# EAGLE design ArduinoUNO_shield (EAGLE 9.6.2)
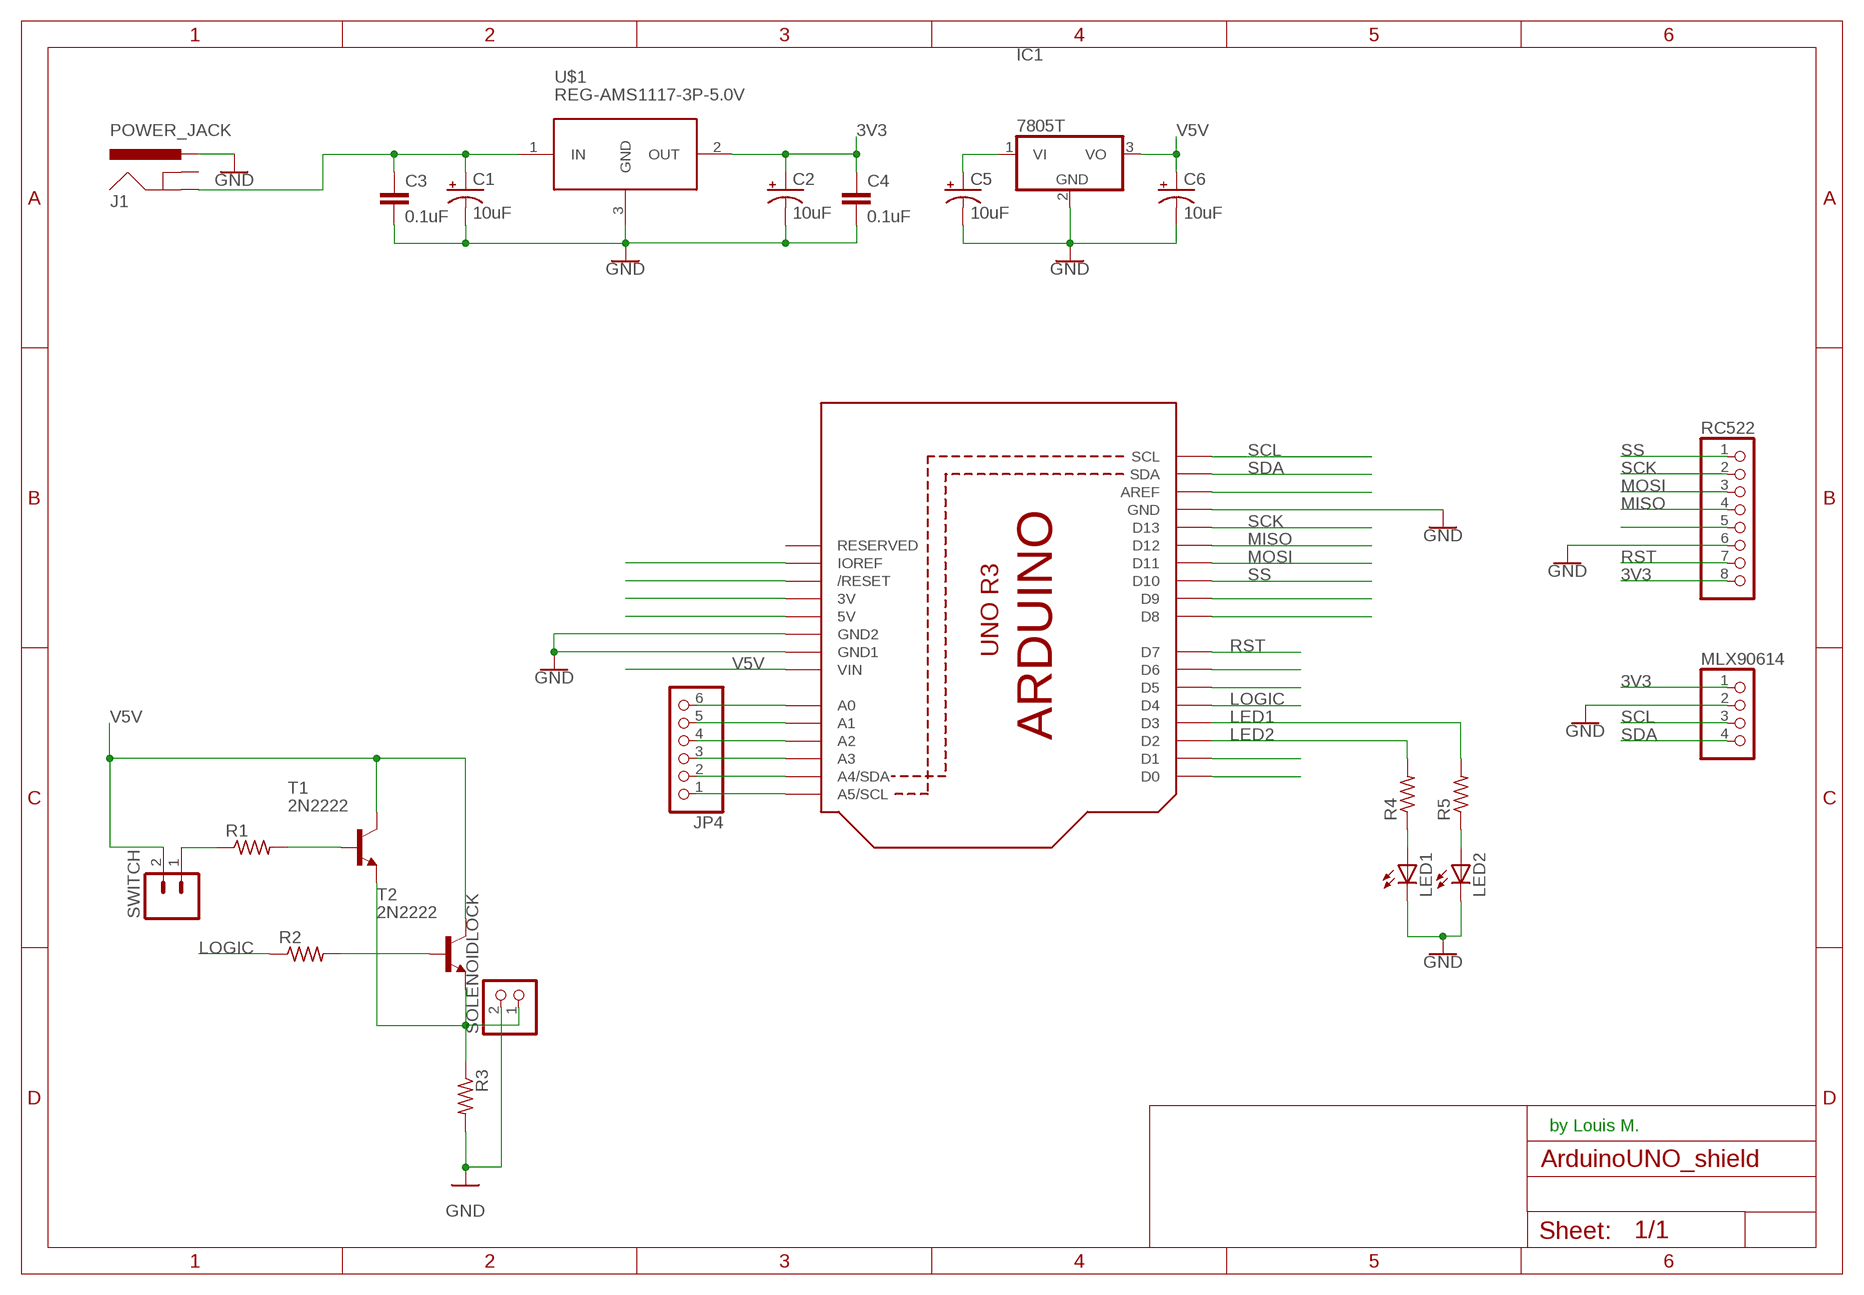
[diagram p0: schematic, sheet 1]

## Parts
C1  10uF  10UF-POLAR-RADIAL-2.5MM-KIT-25V-20%  [CPOL-RADIAL-2.5MM-5MM-KIT]
C2  10uF  10UF-POLAR-RADIAL-2.5MM-KIT-25V-20%  [CPOL-RADIAL-2.5MM-5MM-KIT]
C3  0.1uF  0.1UF-KIT-EZ-50V-20%  [CAP-PTH-SMALL-KIT]
C4  0.1uF  0.1UF-KIT-EZ-50V-20%  [CAP-PTH-SMALL-KIT]
C5  10uF  10UF-POLAR-RADIAL-2.5MM-25V-20%  [CPOL-RADIAL-2.5MM-5MM]
C6  10uF  10UF-POLAR-RADIAL-2.5MM-25V-20%  [CPOL-RADIAL-2.5MM-5MM]
IC1  7805T  [TO220H]
J1  POWER_JACK  [POWER_JACK_PTH]
JP4  PINHD-1X6B  [1X06-BIG]
LED1  LED5MM  [LED5MM]
LED2  LED5MM  [LED5MM]
MLX90614  PINHD-1X4  [1X04]
R1  R-US_0207/10  [0207/10]
R2  R-US_0207/10  [0207/10]
R3  R-US_0207/10  [0207/10]
R4  R-US_0204/5  [0204/5]
R5  R-US_0204/5  [0204/5]
RC522  PINHD-1X8  [1X08]
SOLENOIDLOCK  JST_2PIN-THM-RA  [JST-PH-2-THM-RA]
SWITCH  M02  [02P]
T1  2N2222  [TO92-EBC-OVAL]
T2  2N2222  [TO92-EBC-OVAL]
U$1  REG-AMS1117-3P-5.0V  [REG-AMS1117-3P]
UNOR3  ARDUINOR3-DIMENSION  [ARDUINOR3]

## Nets
3V3: C2.1(+) C4.1 MLX90614.1 RC522.8 U$1.2(OUT)
GND: C1.2(-) C2.2(-) C3.2 C4.2 C5.2(-) C6.2(-) IC1.2(GND) J1.PWR LED1.K(C) LED2.K(C) MLX90614.2 R3.2 RC522.6 SOLENOIDLOCK.2 U$1.3(GND) UNOR3.GND UNOR3.GND1 UNOR3.GND2
LED1: R5.2 UNOR3.D3
LED2: R4.2 UNOR3.D2
LOGIC: R2.1 UNOR3.D4
MISO: RC522.4 UNOR3.D12
MOSI: RC522.3 UNOR3.D11
N$1: R1.2 T1.B
N$2: R1.1 SWITCH.1
N$3: R2.2 T2.B
N$4: UNOR3.AREF
N$5: LED1.A R4.1
N$6: R3.1 SOLENOIDLOCK.1 T1.E T2.E
N$7: LED2.A R5.1
N$8: C5.1(+) IC1.1(VI)
N$9: C1.1(+) C3.1 J1.GND U$1.1(IN)
N$11: UNOR3.D9
N$12: UNOR3.D8
N$14: UNOR3.D6
N$15: UNOR3.D5
N$16: UNOR3.D1
N$17: UNOR3.D0
N$18: JP4.6 UNOR3.A0
N$19: JP4.5 UNOR3.A1
N$20: JP4.4 UNOR3.A2
N$21: JP4.3 UNOR3.A3
N$22: UNOR3.IOREF
N$23: UNOR3.RESET(/RESET)
N$24: UNOR3.3V
N$25: UNOR3.5V
N$27: JP4.2 UNOR3.A4(A4/SDA)
N$28: JP4.1 UNOR3.A5(A5/SCL)
N$33: RC522.5
RST: RC522.7 UNOR3.D7
SCK: RC522.2 UNOR3.D13
SCL: MLX90614.3 UNOR3.SCL
SDA: MLX90614.4 UNOR3.SDA
SS: RC522.1 UNOR3.D10
V5V: C6.1(+) IC1.3(VO) SWITCH.2 T1.C T2.C UNOR3.VIN
Unconnected: J1.GNDBREAK UNOR3.RESERVED

## Notes on the sheet
- by Louis M.

## Library data of the parts
C1 C2 C5 C6 = SparkFun-Capacitors:10UF-POLAR: 10.0µF polarized capacitors A capacitor is a passive two-terminal electrical component used to store electrical energy temporarily in an electric field.; PROD_ID: CAP-08440
C3 C4 = SparkFun-RF:0.1UF: 0.1µF ceramic capacitors A capacitor is a passive two-terminal electrical component used to store electrical energy temporarily in an electric field.; PROD_ID: CAP-08370
IC1 = linear:78*: Positive VOLTAGE REGULATOR Source: http://cache.national.com/ds/LM/LM78L05.pdf http://www.fairchildsemi.com/ds/LM/LM7805.pdf
J1 = SparkFun-Connectors:POWER_JACK: Power Jack Connector This is the standard 5.5mm barrel jack for power. The PTH is the most common, proven, reliable, footprint. The Slot footprint only works if the mill layer is transmitted to the PCB fab house so be warned. Here are the connectors we sell at SparkFun: DC Barrel Power Jack/Connector <https://www.sparkfun.com/products/119> (PRT-00119) DC Barrel Power Jack/Connector (SMD) <https://www.sparkfun.com/products/12748> (PRT-12748) DC Barrel Jack Adapter - Breadboard Compatible <https://www.sparkfun.com/products/10811> (PRT-10811) It is used on this SparkFun product (and many, many others): SparkFun RedBoard - Programmed with Arduino <https://www.sparkfun.com/products/12757> (DEV-12757) Also, if you need a mating power supply or connector, please check these out: Wall Adapter Power Supply - 9VDC 650mA <https://www.sparkfun.com/products/298> (TOL-00298) DC Barrel Jack Adapter - Male <https://www.sparkfun.com/products/10287> (PRT-10287); PROD_ID: CONN-08197
JP4 = adafruit:PINHD-1X6: PIN HEADER
LED1 LED2 = adafruit:LED: LED OSRAM: - CHIPLED LG R971, LG N971, LY N971, LG Q971, LY Q971, LO R971, LY R971 LH N974, LH R974 LS Q976, LO Q976, LY Q976 LO Q996 - Hyper CHIPLED LW Q18S LB Q993, LB Q99A, LB R99A - SideLED LS A670, LO A670, LY A670, LG A670, LP A670 LB A673, LV A673, LT A673, LW A673 LH A674 LY A675 LS A676, LA A676, LO A676, LY A676, LW A676 LS A679, LY A679, LG A679 - Hyper Micro SIDELED® LS Y876, LA Y876, LO Y876, LY Y876 LT Y87S - SmartLED LW L88C, LW L88S LB L89C, LB L89S, LG L890 LS L89K, LO L89K, LY L89K LS L896, LA L896, LO L896, LY L896 - TOPLED LS T670, LO T670, LY T670, LG T670, LP T670 LSG T670, LSP T670, LSY T670, LOP T670, LYG T670 LG T671, LOG T671, LSG T671 LB T673, LV T673, LT T673, LW T673 LH T674 LS T676, LA T676, LO T676, LY T676, LB T676, LH T676, LSB T676, LW T676 LB T67C, LV T67C, LT T67C, LS T67K, LO T67K, LY T67K, LW E67C LS E67B, LA E67B, LO E67B, LY E67B, LB E67C, LV E67C, LT E67C LW T67C LS T679, LY T679, LG T679 LS T770, LO T770, LY T770, LG T770, LP T770 LB T773, LV T773, LT T773, LW T773 LH T774 LS E675, LA E675, LY E675, LS T675 LS T776, LA T776, LO T776, LY T776, LB T776 LHGB T686 LT T68C, LB T68C - Hyper Mini TOPLED® LB M676 - Mini TOPLED Santana® LG M470 LS M47K, LO M47K, LY M47K Source: http://www.osram.convergy.de/
MLX90614 = pinhead:PINHD-1X4: PIN HEADER
R1-R5 = adafruit:R-US_: RESISTOR, American symbol
RC522 = pinhead:PINHD-1X8: PIN HEADER
SOLENOIDLOCK = adafruit:JST_2PIN: JST 2-Pin Connectors of various flavors SMT-RA (S2B-PH-SM4) 4UConnector #17311 SMT (B2B-PH-SM4) THM-RA (S2B-PH) THM (B2B-PH)
SWITCH = con-amp-quick:M02: AMP QUICK CONNECTOR; OC_FARNELL: unknown; OC_NEWARK: unknown
T1 T2 = adafruit:2N2222: NPN TRANSISTOR Big oval pads
U$1 = diy-modules:REG-AMS1117-3P-*: Linear Regulator based on AMS1117 chip 3-pin version AMS1117 datasheet is available here: http://www.advanced-monolithic.com/pdf/ds1117.pdf Click here to find device on ebay.com <http://www.ebay.com/sch/ams1117+module> Note: There are many variants. Search for the proper version.
UNOR3 = adafruit:ARDUINOR3: This is a new object for the new Arduino R3 - with extra pins that you may want to use (such as IOref, and duplicated A4/A5

## Board
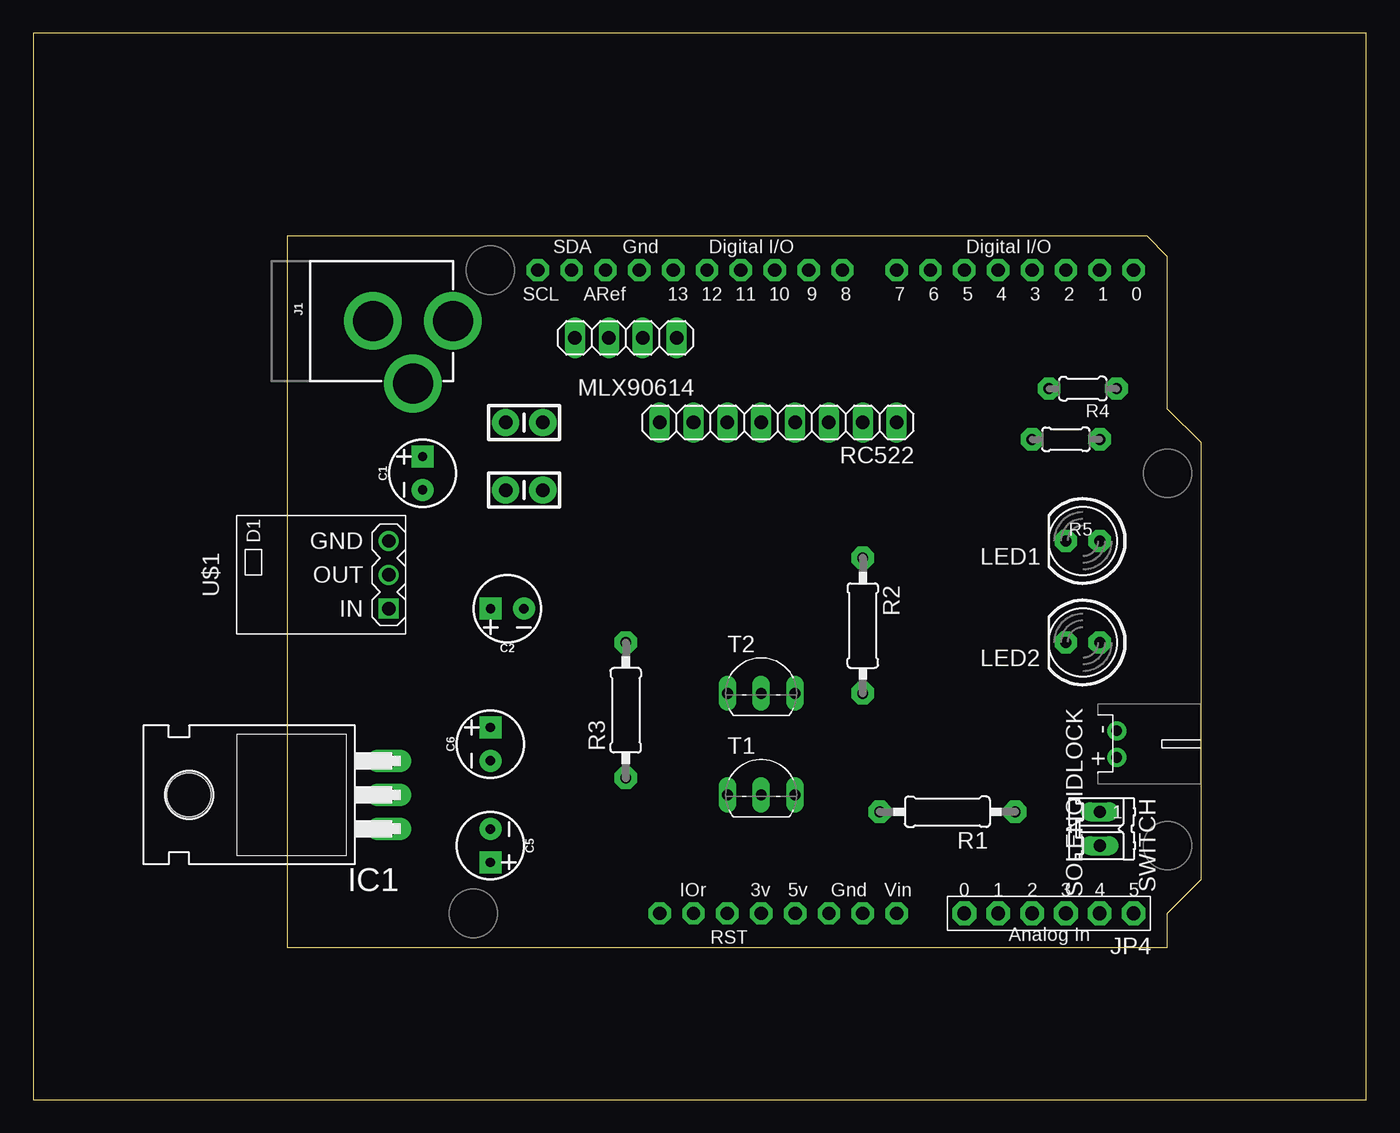
[diagram p1: board, top side]
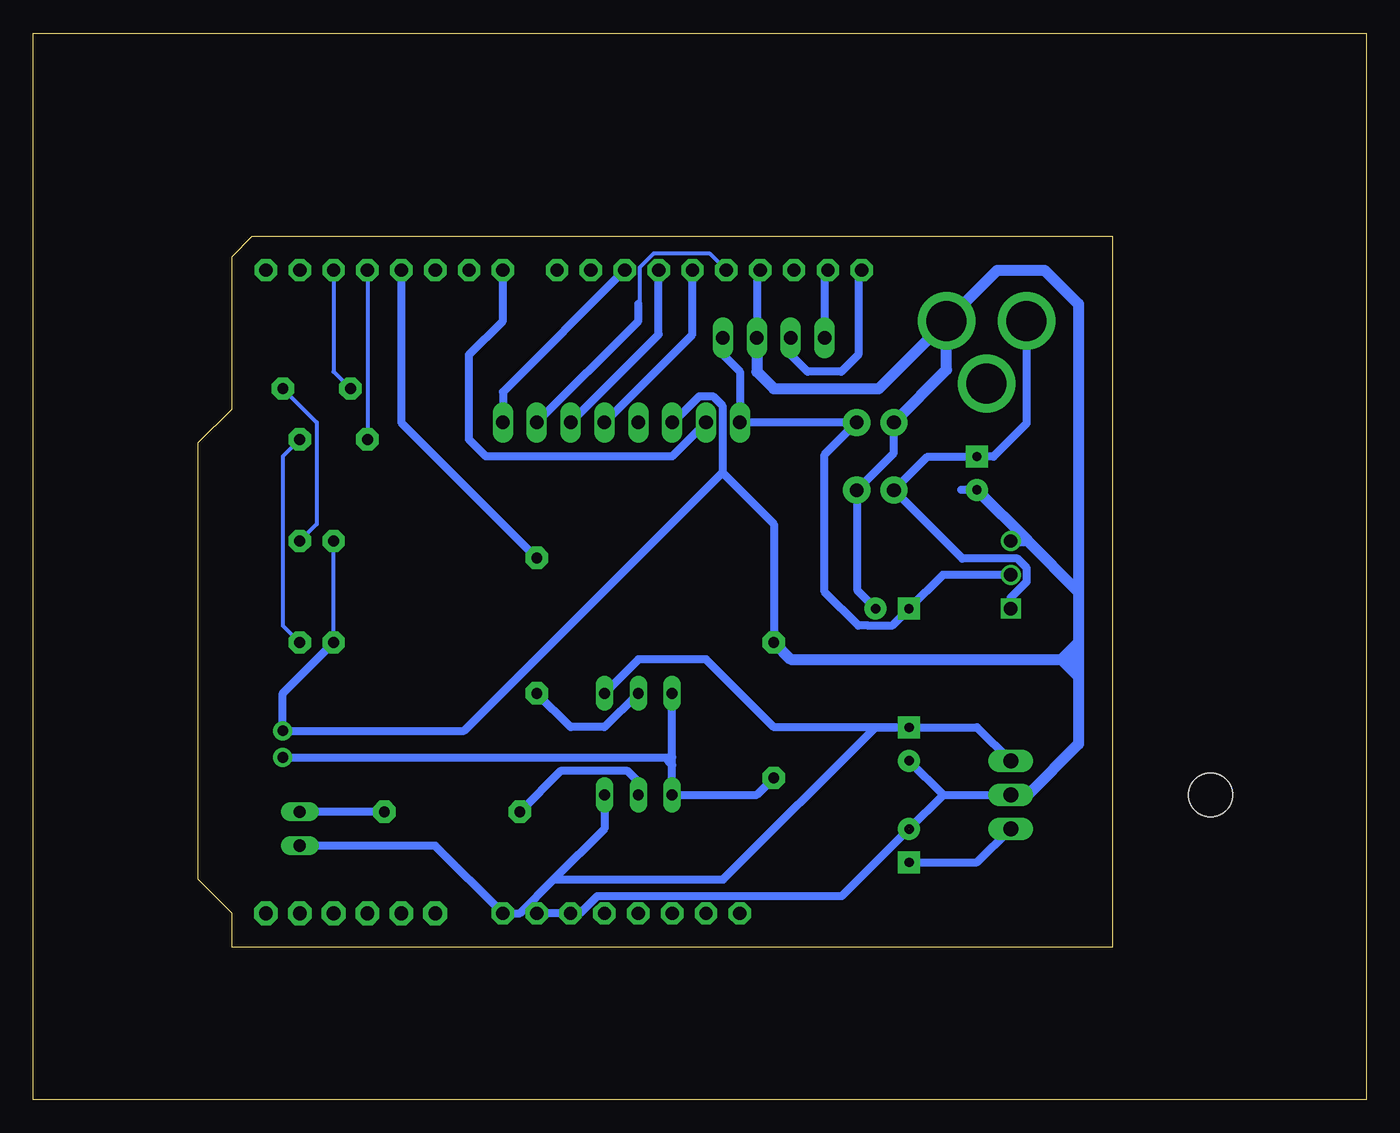
[diagram p2: board, bottom side, seen from below]

Size 100 x 80 mm. Coordinates in mm from the lower left corner, seen from the top.
Outline: 0,0 100,0 100,80 0,80 0,0
Copper layers (1*16): Top 0.035mm / dielectric 1.5mm / Bottom 0.035mm
Design rules "default": minimum track width 6mil, minimum drill 0.35mm, track to track 6mil, track to pad 6mil, pad to pad 6mil, via to via 6mil, smd to smd 6mil, copper to edge 40mil, drill to drill 6mil, minimum pad ring 10mil, minimum via ring 8mil, stop-mask expansion 4mil, vias tented up to drill 0mil, thermal gap 10mil

### Footprints (pad centres in the part's own frame; a part is rotated, then mirrored left to right if it is on the bottom)
CPOL-RADIAL-2.5MM-5MM-KIT = drill 0.7 pad 1.651 square: 1 1.25,0 | drill 0.7 pad 1.651: 2 -1.25,0
CAP-PTH-SMALL-KIT = drill 1.016 pad 2.032: 1 -1.397,0; 2 1.397,0
CPOL-RADIAL-2.5MM-5MM = drill 0.7 pad 1.651 square: 1 1.25,0 | drill 0.7 pad 1.651: 2 -1.25,0
TO220H = drill 1.118 long: 1 -2.54,-10.16; 2 0,-10.16; 3 2.54,-10.16 | hole 3.302: 0,4.826
POWER_JACK_PTH = drill 2.997 pad 4.318: GND 0,7.7; GNDBREAK 4.7,10.7; PWR 0,13.7
1X06-BIG = drill 1.016 pad 1.778 octagon: 1 -6.35,0; 2 -3.81,0; 3 -1.27,0; 4 1.27,0; 5 3.81,0; 6 6.35,0
LED5MM = drill 0.813 pad 1.676 octagon: A -1.27,0; K 1.27,0
1X04 = drill 1.016 long: 1 -3.81,0; 2 -1.27,0; 3 1.27,0; 4 3.81,0
0207/10 = drill 0.813 pad 1.676 octagon: 1 -5.08,0; 2 5.08,0
0204/5 = drill 0.813 pad 1.676 octagon: 1 -2.54,0; 2 2.54,0
1X08 = drill 1.016 long: 1 -8.89,0; 2 -6.35,0; 3 -3.81,0; 4 -1.27,0; 5 1.27,0; 6 3.81,0; 7 6.35,0; 8 8.89,0
JST-PH-2-THM-RA = drill 0.8 pad 1.422: 1 1,0; 2 -1,0
02P = drill 0.914 long: 1 -1.27,0; 2 1.27,0
TO92-EBC-OVAL = drill 0.813 long: B 0,-1.27; C 2.54,-1.27; E -2.54,-1.27
REG-AMS1117-3P = drill 1 square: 1 -2.54,-5.08 | drill 1: 2 0,-5.08; 3 2.54,-5.08
ARDUINOR3 = drill 1 pad 1.676 octagon: 3V 35.56,2.54; 5V 38.1,2.54; A0 50.8,2.54; A1 53.34,2.54; A2 55.88,2.54; A3 58.42,2.54; A4 60.96,2.54; A5 63.5,2.54; AREF 23.876,50.8; D0 63.5,50.8; D1 60.96,50.8; D2 58.42,50.8; D3 55.88,50.8; D4 53.34,50.8; D5 50.8,50.8; D6 48.26,50.8; D7 45.72,50.8; D8 41.656,50.8; D9 39.116,50.8; D10 36.576,50.8; D11 34.036,50.8; D12 31.496,50.8; D13 28.956,50.8; GND 26.416,50.8; GND1 43.18,2.54; GND2 40.64,2.54; IOREF 30.48,2.54; RESERVED 27.94,2.54; RESET 33.02,2.54; SCL 18.796,50.8; SDA 21.336,50.8; VIN 45.72,2.54

### Placement (x,y rotation side)
C1  29.21,46.99 90 top
C2  35.56,36.83 180 top
C3  36.83,45.72 0 top
C4  36.83,50.8 180 top
C5  34.29,19.05 270 top
C6  34.29,26.67 90 top
IC1  16.51,22.86 90 top
J1  17.78,58.42 270 top
JP4  76.2,13.97 180 top
LED1  78.74,41.91 180 top
LED2  78.74,34.29 180 top
MLX90614  44.45,57.15 180 top
R1  68.58,21.59 180 top
R2  62.23,35.56 270 top
R3  44.45,29.21 90 top
R4  78.74,53.34 180 top
R5  77.47,49.53 180 top
RC522  55.88,50.8 180 top
SOLENOIDLOCK  81.28,26.67 270 top
SWITCH  80.01,20.32 270 top
T1  54.61,24.13 0 top
T2  54.61,31.75 0 top
U$1  21.59,39.37 90 top
UNOR3  19.05,11.43 0 top

### Tracks (layer width: path | path; a pad name or v marks a point on that pad's centre or on a via)
3V3
  Bottom 0.61: MLX90614.1 48.26,55.88 46.99,54.61 RC522.8 C4.1 40.64,48.39 40.64,38.1 38.1,35.56 37.35,35.56 37.34,35.55 35.59,35.55 C2.1 31.77,39.37 U$1.2
GND  (1 unrouted)
  Bottom 0.305: LED2.K LED1.K
  Bottom 0.406: C6.2 31.75,22.88 26.68,22.88
  Bottom 0.61: 35.43,49.78 C4.2 35.43,48.51 38.16,45.78 | UNOR3.GND 45.72,61.98 MLX90614.2 | C1.2 30.37,45.74 | C3.2 38.16,45.78 | R3.2 44.45,43.18 48.31,47.04 | RC522.6 52.02,50.8 50.03,52.78 49.02,52.78 48.31,52.07 48.31,47.04 | C2.2 38.16,38.18 38.16,45.78 | C5.2 31.73,22.86 | 31.73,22.86 IC1.2 | C6.2 31.73,22.86 | UNOR3.GND1 UNOR3.GND2 58.98,13.97 57.69,15.27 39.34,15.27 34.29,20.32 | 48.31,47.04 67.68,27.67 SOLENOIDLOCK.2 81.28,30.48 LED2.K
  Bottom 0.813: J1.PWR 27.67,62.23 24.13,62.23 21.59,59.69 21.59,38.1 | 21.59,38.1 21.59,34.29 | 21.59,34.29 21.59,33.02 | 21.59,33.02 21.59,31.75 | 21.59,31.75 21.59,26.67 25.4,22.86 IC1.2 | C4.2 31.48,54.75 J1.PWR | R3.2 43.18,33.02 22.86,33.02 | 22.86,33.02 21.59,33.02 | 22.86,33.02 21.59,34.29 | 22.86,33.02 21.59,31.75 | 21.59,38.1 25.4,41.91 | 25.4,41.91 U$1.3 | C1.2 25.4,41.93 25.4,41.91 | MLX90614.2 45.72,54.61 44.45,53.34 36.56,53.34 J1.PWR
LED1
  Bottom 0.305: UNOR3.D3 R5.2
LED2
  Bottom 0.305: UNOR3.D2 77.47,54.61 R4.2
LOGIC
  Bottom 0.61: UNOR3.D4 72.39,50.8 R2.1
MISO
  Bottom 0.61: RC522.4 50.55,57.4 UNOR3.D12
MOSI
  Bottom 0.61: RC522.3 53.09,57.4 UNOR3.D11
N$1
  Bottom 0.61: T1.B 54.61,23.83 55.42,24.64 60.45,24.64 R1.2
N$2
  Bottom 0.61: R1.1 SWITCH.1
N$3
  Bottom 0.61: T2.B 57.15,27.94 59.69,27.94 R2.2
N$5
  Bottom 0.305: R4.1 78.74,50.8 78.74,43.18 LED1.A
N$6
  Bottom 0.61: T1.E 45.72,22.86 R3.1 | T1.E T2.E | T1.E 52.07,25.1 52.37,25.4 52.34,25.4 52.07,25.67 SOLENOIDLOCK.1
N$7
  Bottom 0.305: R5.1 81.28,48.26 81.28,35.56 LED2.A
N$8
  Bottom 0.61: C5.1 29.19,17.8 IC1.1
N$9
  Bottom 0.61: J1.GND 25.48,50.72 27.96,48.24 C1.1 32.91,48.24 C3.1 30.29,40.58 26.17,40.58 25.46,39.87 25.46,38.87 26.67,37.66 U$1.1
RST
  Bottom 0.61: RC522.7 52.07,48.26 66.04,48.26 67.31,49.53 67.31,55.88 64.77,58.42 UNOR3.D7
SCK
  Bottom 0.305: 54.61,59.69 54.48,59.69 54.48,62.45 53.43,63.5 49.28,63.5 UNOR3.D13
  Bottom 0.61: RC522.2 54.61,58.42 54.61,59.69
SCL
  Bottom 0.61: UNOR3.SCL 38.1,61.98 38.1,55.88 39.37,54.61 41.91,54.61 43.18,55.88 MLX90614.3
SDA
  Bottom 0.61: UNOR3.SDA 40.64,61.98 MLX90614.4
SS
  Bottom 0.61: UNOR3.D10 64.77,53.09 RC522.1
V5V
  Bottom 0.61: C6.1 29.19,27.92 IC1.3 | C6.1 44.43,27.92 49.53,33.02 54.61,33.02 T2.C | 60.96,16.51 63.5,13.97 UNOR3.VIN 69.85,19.05 SWITCH.2 | C6.1 36.83,27.92 48.24,16.51 60.96,16.51 | T1.C 57.15,20.32 60.96,16.51